# Altium schematic sheet Audio.SchDoc: Audio
size A4; DocumentNumber: MB1167; Revision: B.1; SheetNumber: 5; SheetTotal: 17; Project: STM327x6G-EVAL
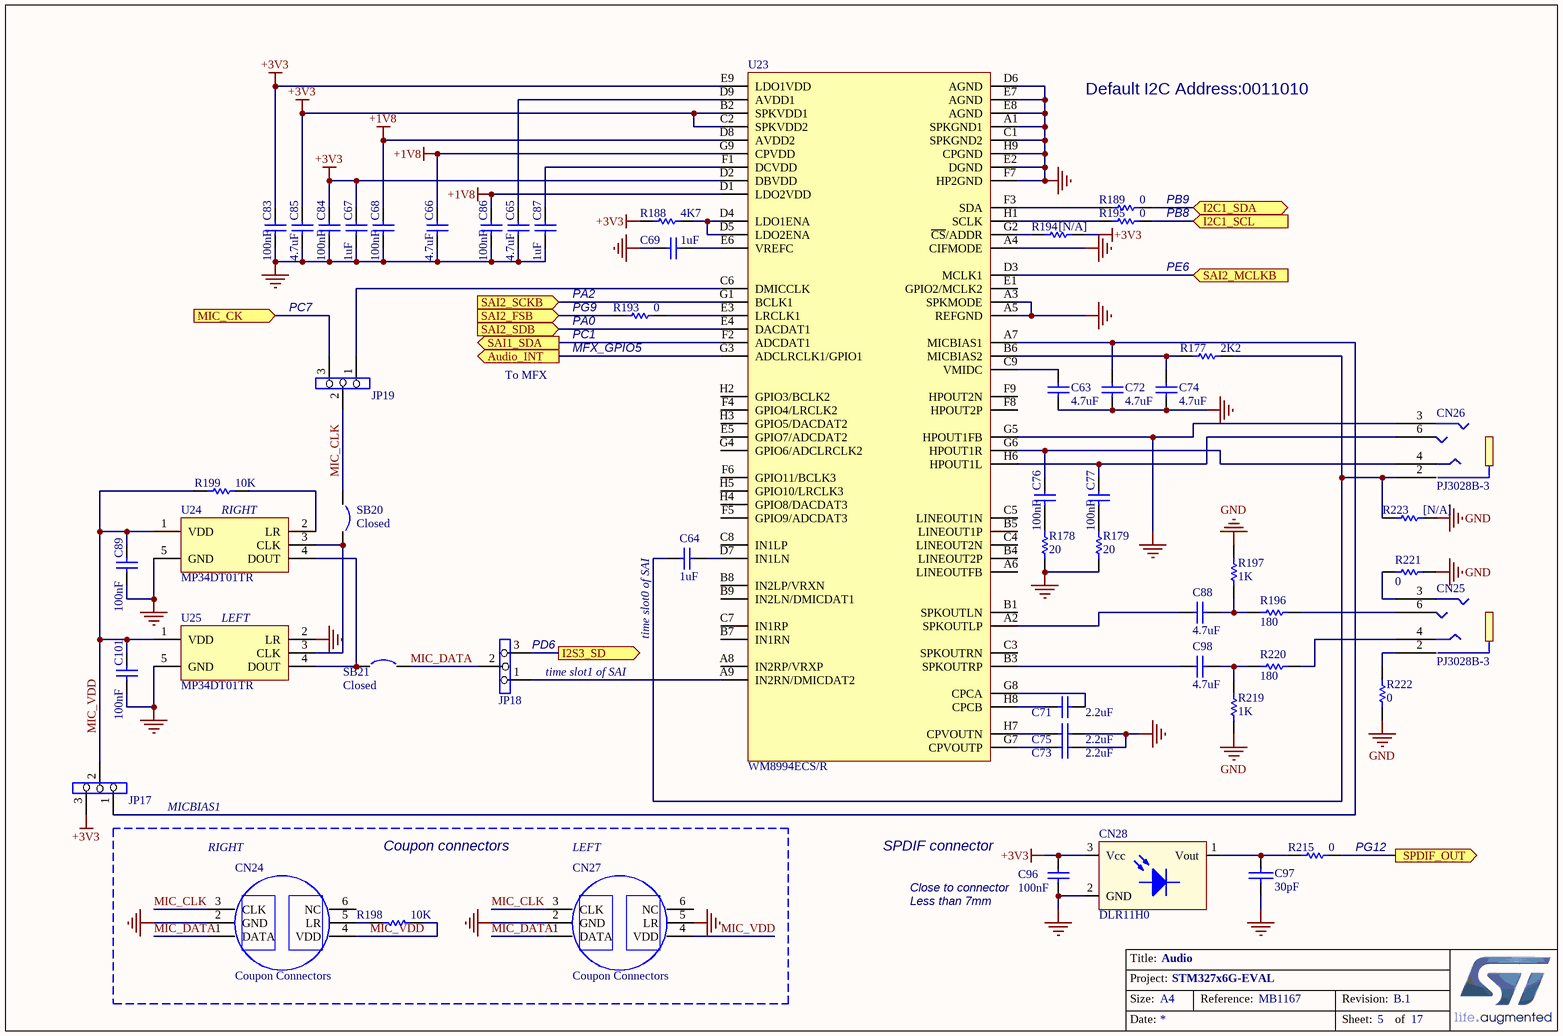
[diagram p0: Audio.SchDoc]

## Parts
C63  4.7uF  [0603C]
C64  1uF  [0603C]
C65  4.7uF  [0603C]
C66  4.7uF  [0603C]
C67  1uF  [0603C]
C68  100nF  [0603C]
C69  1uF  [0603C]
C71  2.2uF  [0603C]
C72  4.7uF  [0603C]
C73  2.2uF  [0603C]
C74  4.7uF  [0603C]
C75  2.2uF  [0603C]
C76  100nF  [0603C]
C77  100nF  [0603C]
C83  100nF  [0603C]
C84  100nF  [0603C]
C85  4.7uF  [0603C]
C86  100nF  [0603C]
C87  1uF  [0603C]
C88  4.7uF  [0603C]
C89  100nF  [0603C]
C96  100nF  [0603C]
C97  30pF  [0603C]
C98  4.7uF  [0603C]
C101  100nF  [0603C]
CN24  Coupon Connectors  [Coupon]
CN25  PJ3028B-3  [PJ3028B]
CN26  PJ3028B-3  [PJ3028B]
CN27  Coupon Connectors  [Coupon]
CN28  DLR11H0  [CONN_DLR11H0]
JP17  (no value)  [SIP3]
JP18  (no value)  [SIP3]
JP19  (no value)  [SIP3]
R177  2K2  [0603R]
R178  20  [0603R]
R179  20  [0603R]
R188  4K7  [0603R]
R189  0  [0603R]
R193  0  [0603R]
R194  [N/A]  [0603R]
R195  0  [0603R]
R196  180  [0402R]
R197  1K  [0402R]
R198  10K  [0603R]
R199  10K  [0603R]
R215  0  [0603R]
R219  1K  [0402R]
R220  180  [0402R]
R221  0  [0603R]
R222  0  [0603R]
R223  [N/A]  [0603R]
SB20  Closed  [SB_0603]
SB21  Closed  [SB_0603]
U23  WM8994ECS/R  [BGA72_0R5_4R5X4]
U24  MP34DT01TR  [MP34DT01TR]
U25  MP34DT01TR  [MP34DT01TR]

## Blocks framed on the sheet
Coupon connectors: CN24 CN27 R198

## Ports
Audio_INT (out), I2C1_SCL (in), I2C1_SDA (bidir), I2S3_SD (out), MIC_CK (in), SAI1_SDA (out), SAI2_FSB (in), SAI2_MCLKB (in), SAI2_SCKB (in), SAI2_SDB (in), SPDIF_OUT (out)

## Nets
+1V8: C66.1 C68.1 C86.1 U23.D1(LDO2VDD) U23.D8(AVDD2) U23.G9(CPVDD)
+3V3: C67.1 C83.1 C84.1 C85.1 C96.2 CN28.3(Vcc) JP17.3 R188.2 R194.1 U23.B2(SPKVDD1) U23.C2(SPKVDD2) U23.D2(DBVDD) U23.E9(LDO1VDD)
GND: C63.1 C65.2 C66.2 C67.2 C68.2 C69.2 C72.1 C73.2 C74.1 C75.2 C83.2 C84.2 C85.2 C86.2 C87.2 C89.2 C96.1 C97.2 C101.2 CN24.2(GND) CN26.3 CN27.2(GND) CN27.5(LR) CN28.2(GND) R178.2 R179.2 R197.2 R219.1 R221.2 R222.2 R223.1 U23.A1(SPKGND1) U23.A3(SPKMODE) U23.A4(CIFMODE) U23.A5(REFGND) U23.C1(SPKGND2) U23.D6(AGND) U23.E2(DGND) U23.E7(AGND) U23.E8(AGND) U23.F7(HP2GND) U23.G5(HPOUT1FB) U23.H9(CPGND) U24.5(GND) U25.2(LR) U25.5(GND)
Audio_INT: U23.G3(ADCLRCLK1/GPIO1) ; port Audio_INT
I2C1_SCL: R195.1 ; port I2C1_SCL
I2C1_SDA: R189.1 ; port I2C1_SDA
I2S3_SD: JP18.3 ; port I2S3_SD
MIC_CK: JP19.3 ; port MIC_CK
MIC_CLK: CN24.3(CLK) CN27.3(CLK) JP19.2 SB20.1
MIC_DATA: CN24.1(DATA) CN27.1(DATA) JP18.2 SB21.2
MIC_VDD: C89.1 C101.1 CN24.4(VDD) CN27.4(VDD) JP17.2 R198.2 R199.2 U24.1(VDD) U25.1(VDD)
SAI1_SDA: U23.F2(ADCDAT1) ; port SAI1_SDA
SAI2_FSB: R193.2 ; port SAI2_FSB
SAI2_MCLKB: U23.D3(MCLK1) ; port SAI2_MCLKB
SAI2_SCKB: U23.G1(BCLK1) ; port SAI2_SCKB
SAI2_SDB: U23.E4(DACDAT1) ; port SAI2_SDB
SPDIF_OUT: R215.1 ; port SPDIF_OUT
NetC63_2: C63.2 U23.C9(VMIDC)
NetC64_1: C64.1 U23.D7(IN1LN)
NetC64_2: C64.2 CN26.2 R177.1 R223.2
NetC65_1: C65.1 U23.D9(AVDD1)
NetC69_1: C69.1 U23.E6(VREFC)
NetC71_1: C71.1 U23.H8(CPCB)
NetC71_2: C71.2 U23.G8(CPCA)
NetC72_2: C72.2 JP17.1 U23.A7(MICBIAS1)
NetC73_1: C73.1 U23.G7(CPVOUTP)
NetC74_2: C74.2 R177.2 U23.B6(MICBIAS2)
NetC75_1: C75.1 U23.H7(CPVOUTN)
NetC76_1: C76.1 CN26.4 U23.G6(HPOUT1R)
NetC76_2: C76.2 R178.1
NetC77_1: C77.1 CN26.6 U23.H6(HPOUT1L)
NetC77_2: C77.2 R179.1
NetC87_1: C87.1 U23.F1(DCVDD)
NetC88_1: C88.1 R196.1 R197.1
NetC88_2: C88.2 U23.A2(SPKOUTLP)
NetC97_1: C97.1 CN28.1(Vout) R215.2
NetC98_1: C98.1 R219.2 R220.2
NetC98_2: C98.2 U23.B3(SPKOUTRP)
NetCN24_5: CN24.5(LR) R198.1
NetCN25_2: CN25.2 R222.1
NetCN25_3: CN25.3 R221.1
NetCN25_4: CN25.4 R220.1
NetCN25_6: CN25.6 R196.2
NetJP18_1: JP18.1 U23.A9(IN2RN/DMICDAT2)
NetJP19_1: JP19.1 U23.C6(DMICCLK)
NetR188_1: R188.1 U23.D4(LDO1ENA) U23.D5(LDO2ENA)
NetR189_2: R189.2 U23.F3(SDA)
NetR193_1: R193.1 U23.E3(LRCLK1)
NetR194_2: R194.2 U23.G2(~{CS}/ADDR)
NetR195_2: R195.2 U23.H1(SCLK)
NetR199_1: R199.1 U24.2(LR)
NetSB20_2: SB20.2 U24.3(CLK) U25.3(CLK)
NetSB21_1: SB21.1 U24.4(DOUT) U25.4(DOUT)

Not connected (* = marked no-connect by the designer): CN24 6(NC); CN27 6(NC); U23 A6(LINEOUTFB) A8(IN2RP/VRXP) B1(SPKOUTLN) B4(LINEOUT2P) B5(LINEOUT1P) B7(IN1RN) B8(IN2LP/VRXN) B9(IN2LN/DMICDAT1) C3(SPKOUTRN) C4(LINEOUT2N) C5(LINEOUT1N) C7(IN1RP) C8(IN1LP) E1(GPIO2/MCLK2) E5(GPIO7/ADCDAT2) F4(GPIO4/LRCLK2) F5(GPIO9/ADCDAT3) F6(GPIO11/BCLK3) F8(HPOUT2P) F9(HPOUT2N) G4(GPIO6/ADCLRCLK2) H2(GPIO3/BCLK2) H3(GPIO5/DACDAT2) H4(GPIO8/DACDAT3) H5(GPIO10/LRCLK3)

## Notes on the sheet
- Default I2C Address:0011010
- PB9
- PB8
- PC7
- PA2
- (near R193) PG9
- PE6
- To MFX
- (near R193) PA0
- (near R193) PC1
- (near R193) MFX_GPIO5
- RIGHT
- (near U25) LEFT
- (near JP18) PD6
- (near C64) time slot0 of SAI
- (near JP18) time slot1 of SAI
- MICBIAS1
- LEFT
- SPDIF connector
- (near R215) PG12
- (near C96) Close to connector
- Less than 7mm
- Title:
- Project:
- Size:
- Date:
- A4
- Reference:
- Sheet:
- Revision:
- of

## Library data of the parts
C63 C65 C66 C68 C72 C74 C76 C77 C83-C86 C89 C96 C101 = Cap: Capacitor; Value: 10nF; Published: 8-Jun-2000; Revision: July-2002: Re-released for DXP Platform.; Publisher: Altium Limited
C64 C67 C69 C71 C73 C75 C87 = CAP: Capacitor; Value: 100nF; Published: 8-Jun-2000; Revision: July-2002: Re-released for DXP Platform.; Publisher: Altium Limited
C88 C98 = Cap: Capacitor; Value: 10nF; Ordered by: Subcon; Published: 8-Jun-2000; Revision: July-2002: Re-released for DXP Platform.; Publisher: Altium Limited
C97 = CAP: Capacitor
CN24 CN27 = Coupon Connectors: Header, 3-Pin, Single row; Revision: 17-Jul-2002: Re-released for DXP Platform.; Publisher: Altium Limited
CN28 = OPTO
JP17-JP19 = Jumper3
R177-R179 R188 R189 R193-R195 R198 R199 R215 R223 = Res1: Resistor; Value: 1K; Published: 8-Jun-2000; Revision: July-2002: Re-released for DXP Platform.; Publisher: Altium Limited
R196 R220-R222 = Res1: Resistor; Value: 1K; Ordered by: Subcon; Published: 8-Jun-2000; Revision: July-2002: Re-released for DXP Platform.; Publisher: Altium Limited
R197 R219 = Res1: Resistor; Ordered by: Subcon; Published: 8-Jun-2000; Revision: July-2002: Re-released for DXP Platform.; Publisher: Altium Limited; Value: 1K
SB20 SB21 = Circuit Breaker_close: Circuit Breaker; Published: 24-Mar-1999; Revision: July-2002: Re-released for DXP Platform.; Publisher: Altium Limited
U24 U25 = MP34DT01TR: MEMS audio sensor; Revision: 17-Jul-2002: Re-released for DXP Platform.; Publisher: Altium Limited